# EAGLE design earing (EAGLE 9.5.0)
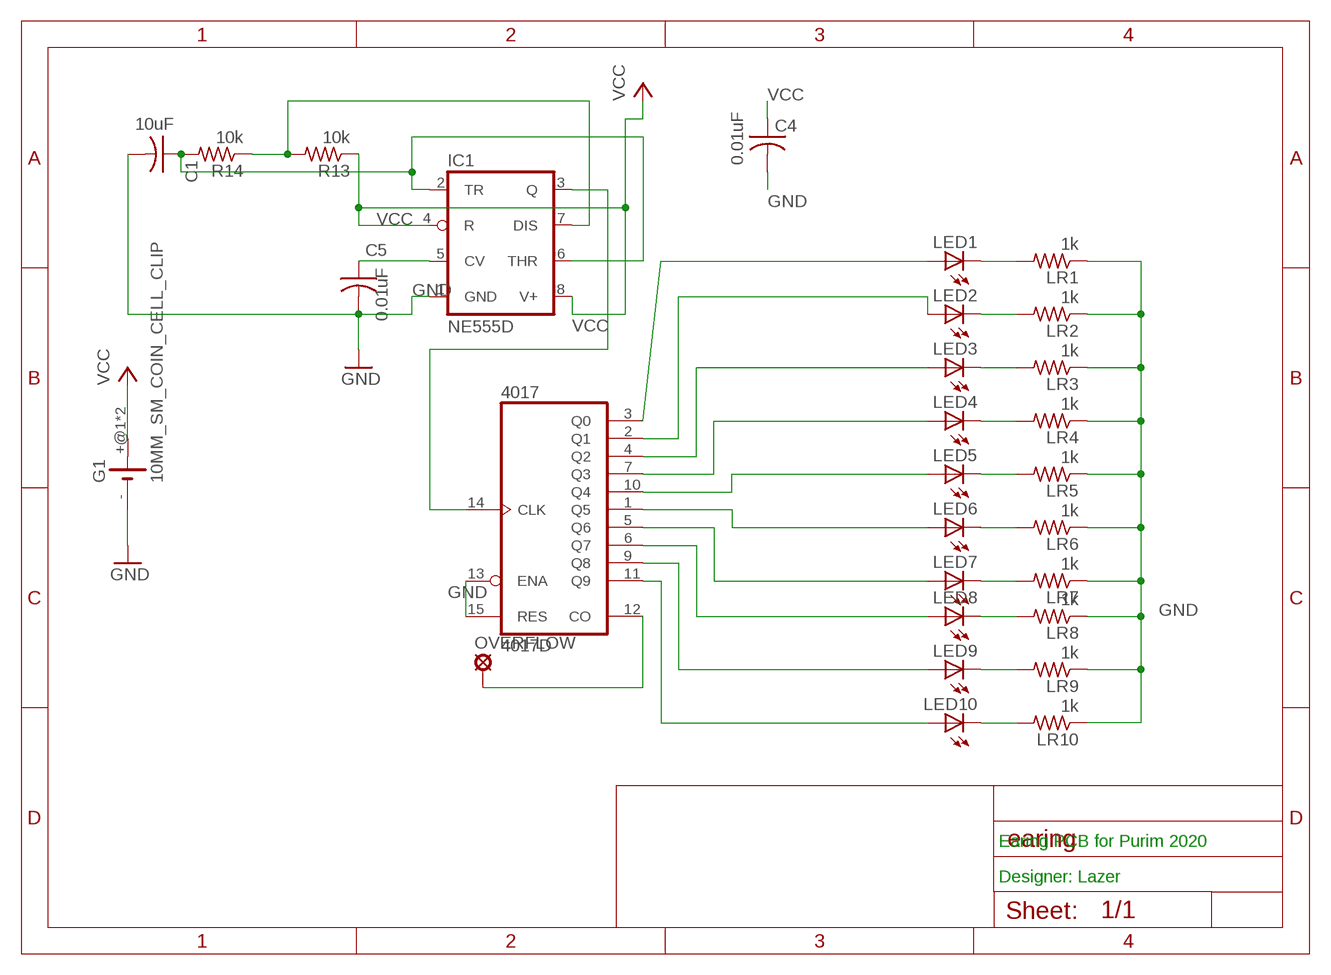
[diagram p0: schematic, sheet 1]

## Parts
4017  4017D  [SO16]
C1  10uF  C-USC0805  [C0805]
C4  0.01uF  C-USC0805  [C0805]
C5  0.01uF  C-USC0805  [C0805]
G1  10MM_SM_COIN_CELL_CLIP  [10MM_SM_COIN_CELL_CLIP]
IC1  NE555D  [SO08]
LED1  LEDCHIP-LED0805  [CHIP-LED0805]
LED2  LEDCHIP-LED0805  [CHIP-LED0805]
LED3  LEDCHIP-LED0805  [CHIP-LED0805]
LED4  LEDCHIP-LED0805  [CHIP-LED0805]
LED5  LEDCHIP-LED0805  [CHIP-LED0805]
LED6  LEDCHIP-LED0805  [CHIP-LED0805]
LED7  LEDCHIP-LED0805  [CHIP-LED0805]
LED8  LEDCHIP-LED0805  [CHIP-LED0805]
LED9  LEDCHIP-LED0805  [CHIP-LED0805]
LED10  LEDCHIP-LED0805  [CHIP-LED0805]
LR1  1k  R-US_M0805  [M0805]
LR2  1k  R-US_M0805  [M0805]
LR3  1k  R-US_M0805  [M0805]
LR4  1k  R-US_M0805  [M0805]
LR5  1k  R-US_M0805  [M0805]
LR6  1k  R-US_M0805  [M0805]
LR7  1k  R-US_M0805  [M0805]
LR8  1k  R-US_M0805  [M0805]
LR9  1k  R-US_M0805  [M0805]
LR10  1k  R-US_M0805  [M0805]
OVERFLOW  LSP10  [LSP10]
R13  10k  R-US_M0805  [M0805]
R14  10k  R-US_M0805  [M0805]

## Nets
GND: 4017.13(ENA) 4017.15(RES) C1.2 C4.2 C5.2 G1.- IC1.1(GND) LR1.1 LR2.1 LR3.1 LR4.1 LR5.1 LR6.1 LR7.1 LR8.1 LR9.1 LR10.1
N$1: 4017.3(Q0) LED1.A
N$2: 4017.12(CO) OVERFLOW.MP
N$3: 4017.2(Q1) LED2.A
N$6: 4017.4(Q2) LED3.A
N$8: 4017.7(Q3) LED4.A
N$9: 4017.10(Q4) LED5.A
N$10: 4017.1(Q5) LED6.A
N$11: 4017.5(Q6) LED7.A
N$12: 4017.6(Q7) LED8.A
N$13: 4017.9(Q8) LED9.A
N$14: 4017.11(Q9) LED10.A
N$15: LED10.C LR10.2
N$16: LED9.C LR9.2
N$17: LED8.C LR8.2
N$18: LED7.C LR7.2
N$19: LED6.C LR6.2
N$20: LED5.C LR5.2
N$21: LED4.C LR4.2
N$22: LED3.C LR3.2
N$23: LED2.C LR2.2
N$24: LED1.C LR1.2
N$27: C5.1 IC1.5(CV)
N$29: IC1.7(DIS) R13.2 R14.1
N$30: 4017.14(CLK) IC1.3(Q)
N$31: C1.1 IC1.2(TR) IC1.6(THR) R14.2
VCC: C4.1 G1.+@1(+) G1.+@2(+) IC1.4(R) IC1.8(V+) R13.1

## Notes on the sheet
- Earing PCB for Purim 2020
- Designer: Lazer

## Power pins joined to a net without a drawn wire
VCC: 4017.16(VDD)
VSS: 4017.8(VSS)

## Library data of the parts
4017 = 40xx:4017: COUNTER/DIVIDER
C1 C4 C5 = adafruit:C-US: CAPACITOR, American symbol
G1 = battery:10MM_SM_COIN_CELL_CLIP: Battery cell clip for CR927 Source: KEYSTONE ELECTRONICS CORP. www.keyelco.com, ASTORIA, N.Y. 11105-2017 PART ANME 10mm SM COIN CELl CLIP DWG NO. 3030
IC1 = adafruit:*555: TIMER Changed DIP package to have round (not oval) pin pads http://www.ladyada.net/library/pcb/eaglelibrary.html
LED1-LED10 = adafruit:LED: LED OSRAM: - CHIPLED LG R971, LG N971, LY N971, LG Q971, LY Q971, LO R971, LY R971 LH N974, LH R974 LS Q976, LO Q976, LY Q976 LO Q996 - Hyper CHIPLED LW Q18S LB Q993, LB Q99A, LB R99A - SideLED LS A670, LO A670, LY A670, LG A670, LP A670 LB A673, LV A673, LT A673, LW A673 LH A674 LY A675 LS A676, LA A676, LO A676, LY A676, LW A676 LS A679, LY A679, LG A679 - Hyper Micro SIDELED® LS Y876, LA Y876, LO Y876, LY Y876 LT Y87S - SmartLED LW L88C, LW L88S LB L89C, LB L89S, LG L890 LS L89K, LO L89K, LY L89K LS L896, LA L896, LO L896, LY L896 - TOPLED LS T670, LO T670, LY T670, LG T670, LP T670 LSG T670, LSP T670, LSY T670, LOP T670, LYG T670 LG T671, LOG T671, LSG T671 LB T673, LV T673, LT T673, LW T673 LH T674 LS T676, LA T676, LO T676, LY T676, LB T676, LH T676, LSB T676, LW T676 LB T67C, LV T67C, LT T67C, LS T67K, LO T67K, LY T67K, LW E67C LS E67B, LA E67B, LO E67B, LY E67B, LB E67C, LV E67C, LT E67C LW T67C LS T679, LY T679, LG T679 LS T770, LO T770, LY T770, LG T770, LP T770 LB T773, LV T773, LT T773, LW T773 LH T774 LS E675, LA E675, LY E675, LS T675 LS T776, LA T776, LO T776, LY T776, LB T776 LHGB T686 LT T68C, LB T68C - Hyper Mini TOPLED® LB M676 - Mini TOPLED Santana® LG M470 LS M47K, LO M47K, LY M47K Source: http://www.osram.convergy.de/
LR1-LR10 R13 R14 = adafruit:R-US_: RESISTOR, American symbol
OVERFLOW = solpad:LSP10: SOLDER PAD drill 1.0 mm, distributor Buerklin, 12H555

## Board
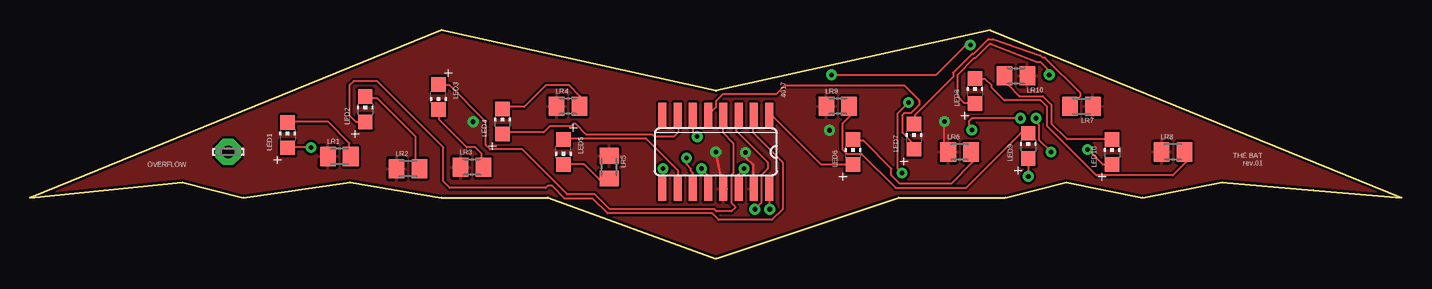
[diagram p1: board, top side]
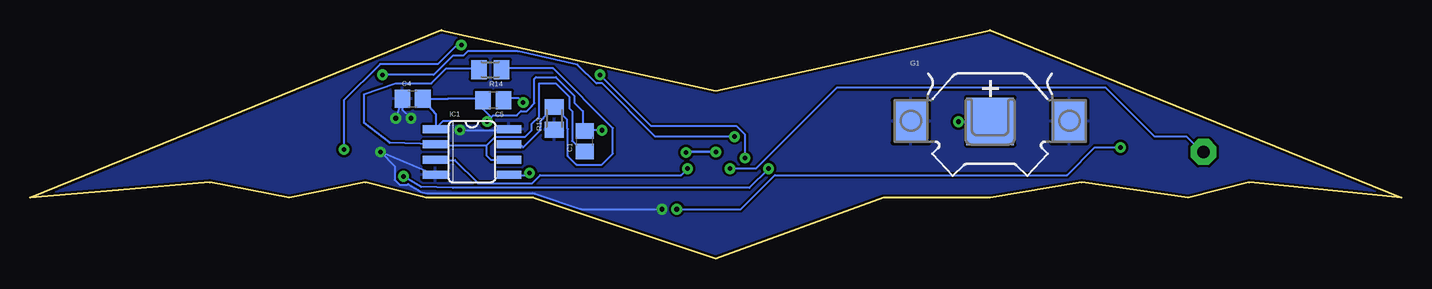
[diagram p2: board, bottom side, seen from below]

Size 114.3 x 19.05 mm. Coordinates in mm from the lower left corner, seen from the top.
Outline: 80.01,19.05 57.15,13.97 34.29,19.05 0,5.08 12.7,6.35 17.78,5.08 26.67,6.35 34.29,5.08 43.18,5.08 57.15,0 72.39,5.08 81.28,5.08 86.36,6.35 92.71,5.08 99.31,6.35 106.93,5.72 114.3,5.08 80.01,19.05
Copper layers (1*16): Top 0.035mm / dielectric 1.5mm / Bottom 0.035mm
Design rules "SparkFun *": minimum track width 6mil, minimum drill 15mil, track to track 8mil, track to pad 8mil, pad to pad 8mil, via to via 8mil, smd to smd 8mil, copper to edge 8mil, drill to drill 8mil, minimum pad ring 12mil, minimum via ring 10mil, stop-mask expansion 4mil, vias tented up to drill 20mil, thermal gap 10mil

### Footprints (pad centres in the part's own frame; a part is rotated, then mirrored left to right if it is on the bottom)
SO16 = smd 0.66 x 2.032: 1 -4.445,-3.073; 2 -3.175,-3.073; 3 -1.905,-3.073; 4 -0.635,-3.073; 5 0.635,-3.073; 6 1.905,-3.073; 7 3.175,-3.073; 8 4.445,-3.073; 9 4.445,3.073; 10 3.175,3.073; 11 1.905,3.073; 12 0.635,3.073; 13 -0.635,3.073; 14 -1.905,3.073; 15 -3.175,3.073; 16 -4.445,3.073
C0805 = smd 1.3 x 1.5: 1 -0.85,0; 2 0.85,0
10MM_SM_COIN_CELL_CLIP = smd 2.9 x 3.5: +@1 -6.6,0; +@2 6.6,0 | smd 3.96 x 3.96: - 0,0
SO08 = smd 0.66 x 2.032: 1 -1.905,-3.073; 2 -0.635,-3.073; 3 0.635,-3.073; 4 1.905,-3.073; 5 1.905,3.073; 6 0.635,3.073; 7 -0.635,3.073; 8 -1.905,3.073
CHIP-LED0805 = smd 1.2 x 1.2: A 0,-1.05; C 0,1.05
M0805 = smd 1.3 x 1.6: 1 -0.95,0; 2 0.95,0
LSP10 = drill 1.016 pad 2.159 octagon: MP 0,0

### Placement (x,y rotation side)
4017  57.15,8.89 180 top
C1  68.07,9.78 90 bottom
C4  82.42,13.33 0 bottom
C5  75.69,13.21 180 bottom
G1  34.29,11.43 0 bottom
IC1  77.47,8.89 270 bottom
LED1  21.46,10.29 0 top
LED2  27.94,12.45 0 top
LED3  34.04,13.46 180 top
LED4  39.37,11.43 0 top
LED5  44.45,8.89 180 top
LED6  68.58,8.89 0 top
LED7  73.66,10.16 0 top
LED8  78.74,13.97 0 top
LED9  83.18,9.4 0 top
LED10  90.17,8.89 0 top
LR1  25.78,8.51 0 top
LR2  31.5,7.49 0 top
LR3  36.83,7.62 0 top
LR4  44.83,12.7 0 top
LR5  48.26,7.62 270 top
LR6  77.47,8.89 0 top
LR7  87.63,12.7 180 top
LR8  95.25,8.89 0 top
LR9  67.31,12.7 0 top
LR10  82.17,15.24 180 top
OVERFLOW  16.51,8.89 0 top
R13  70.61,11.68 90 bottom
R14  75.95,15.75 180 bottom

### Tracks (layer width: path | path; a pad name or v marks a point on that pad's centre or on a via)
GND  (via drill 0.38)
  Top 0.152: LR6.1 76.2,9.21 v76.2,11.43
  Top 0.203: 4017.15 60.26,5.88 60.26,7.8 59.69,8.38 59.69,8.89 v59.63,8.83 | v57.15,8.89 4017.13
  Bottom 0.152: v66.62,10.69 68.05,10.69 C1.2 68.22,10.69 68.22,12.29 68.94,13 68.94,13.56 70.48,15.11 72.14,15.11 72.26,14.99 72.26,12.95 72.48,12.74 72.48,12.7 72.9,12.28 73.39,12.28 73.74,11.94 75.69,11.94 75.87,11.76 76.58,12.47 76.58,13.18 C5.2 76.58,13.36 79.43,13.36 79.47,13.33 C4.2 80.49,12.06 80.49,10.87 IC1.1 79.91,11.43 v76.2,11.43 | v36.93,11.4 34.44,11.4 G1.-
  Bottom 0.203: v59.63,8.83 59.69,8.89 v57.15,8.89
  pour Top: 0,5.08 34.29,19.05 57.15,13.97 80.01,19.05 114.3,5.08 99.06,6.35 92.71,5.08 86.36,6.35 81.28,5.08 72.39,5.08 57.15,0 43.18,5.08 34.29,5.08 26.67,6.35 17.78,5.08 12.7,6.35
N$1  (via drill 0.38)
  Top 0.152: v23.42,9.27 21.46,9.27 LED1.A | v60.4,4.11 60.94,4.65 60.94,6.96 61.47,7.49 61.47,8.03 58.8,10.69 58.98,10.87 58.98,11.94 4017.3
  Bottom 0.152: v23.42,9.27 25.55,9.27 27.86,6.96 52.22,6.96 55.07,4.11 v60.4,4.11
N$2  (via drill 0.38)
  Top 0.152: v55.96,7.49 56.49,6.96 56.49,5.89 4017.12
  Bottom 0.152: v55.96,7.49 53.82,7.49 47.07,14.25 24.66,14.25 20.57,10.16 17.91,10.16 16.66,8.91 OVERFLOW.MP
N$3
  Top 0.152: LED2.A 27.86,11.4 27.15,11.4 26.62,11.94 26.62,14.43 26.98,14.78 28.93,14.78 34.44,9.27 34.44,6.43 34.98,5.89 42.98,5.89 43.16,6.07 43.51,6.07 44.58,5 46.89,5 48.13,3.76 56.84,3.76 57.38,3.23 61.82,3.23 62.71,4.11 62.71,8.03 60.22,10.52 60.22,11.94 4017.2
N$6
  Top 0.152: LED3.A 34.09,14.43 34.98,14.43 38,11.4 38,9.45 38.35,9.09 41.02,9.09 44.76,5.36 47.07,5.36 48.31,4.11 57.02,4.11 57.2,3.94 58.45,3.94 58.8,4.29 58.45,4.65 58.45,6.96 58.62,7.14 58.62,9.63 57.73,10.52 57.73,11.94 4017.4
N$8
  Top 0.152: LED4.A 39.42,10.52 42.8,10.52 43.33,11.05 45.11,11.05 45.29,11.23 45.47,11.23 46.36,10.34 51.87,10.34 52.05,10.16 53.65,10.16 54,10.52 54,11.94 4017.7
N$9
  Top 0.152: LED5.A 44.58,9.98 51.33,9.98 54,7.32 54,5.89 4017.10
N$10
  Top 0.152: LED6.A 65.91,7.85 61.65,12.12 4017.1
N$11
  Top 0.152: LED7.A 73.56,9.27 73.56,9.63 72.67,10.52 72.67,11.94 72.85,12.12 73.38,12.12 74.09,12.83 74.09,13.18 72.85,14.43 62.89,14.43 62.18,13.72 57.73,13.72 57.15,13.13 57.15,12.6 4017.5
N$12  (via drill 0.38)
  Top 0.152: v84.94,15.32 84.94,15.67 84.23,16.38 83.98,16.38 80.01,17.91 79.99,17.91 78.81,16.73 78.7,16.73 77.29,15.32 77.29,13.54 77.83,13 78.71,13 LED8.A | v55.6,10.16 55.24,10.52 4017.6
  Bottom 0.152: v84.94,15.32 80.67,15.32 79.07,16.92 78.18,16.92 77.83,17.27 73.65,17.27 68.68,16.17 67.1,14.59 66.61,14.59 62.18,10.16 v55.6,10.16
N$13  (via drill 0.38)
  Top 0.152: v52.76,7.49 52.76,5.89 4017.9 | LED9.A v83.18,6.86
  Bottom 0.152: v52.76,7.49 54.36,5.89 79.07,5.89 81.73,5.98 v83.18,6.86
N$14  (via drill 0.38)
  Top 0.152: v88.14,9.09 89.38,7.85 90.09,7.85 LED10.A | v78.36,17.8 78,17.8 75.51,15.32 v66.8,15.32 | v54.71,8.38 54.71,7.85 55.07,7.49 55.07,7.32 55.24,7.14 4017.11
  Bottom 0.152: v88.14,9.09 88.14,13.18 85.11,16.2 80.31,16.2 78.71,17.8 v78.36,17.8 | v66.8,15.32 62.54,11.05 55.42,11.05 54.71,10.34 v54.71,8.38
N$15
  Top 0.152: LED10.C 90.09,9.98 86.38,9.98 85.11,11.25 85.11,12.83 84.4,13.54 82.45,13.54 81.56,14.43 81.24,15.21 LR10.2
N$16
  Top 0.152: LED9.C 82.56,10.45 78,5.89 72.14,5.89 69.29,8.74 68.05,8.74 67.69,9.09 67.69,11.23 68.4,11.94 68.4,12.65 LR9.2
N$17
  Top 0.152: LED8.C 78.89,14.96 79.6,14.96 80.14,14.43 80.14,14.25 81.2,13.18 84.23,13.18 84.76,12.65 84.76,11.05 88.88,6.93 95.22,6.93 96.32,8.03 96.32,8.74 LR8.2
N$18
  Top 0.152: LR7.2 87.5,13.52 87.5,13.82 84.58,16.74 84.4,16.74 84.23,16.92 80.26,18.29 79.86,18.29 78.66,17.08 78.52,17.08 76.94,15.49 76.94,15.14 73.74,11.94 73.74,11.23 LED7.C
N$19
  Top 0.152: LED6.C 68.58,9.8 69.47,9.8 71.78,7.49 71.78,6.96 72.49,6.25 76.76,6.25 78.54,8.03 78.54,8.74 LR6.2
N$20
  Top 0.152: LED5.C 44.58,7.85 46.18,7.85 47.42,6.6 48.13,6.6 LR5.2
N$21
  Top 0.152: LED4.C 39.42,12.65 41.2,12.65 42.98,14.43 44.93,14.43 45.82,13.54 45.82,12.83 LR4.2
N$22
  Top 0.152: LED3.C 34.09,12.29 34.09,11.58 36.4,9.27 37.11,9.27 37.64,8.74 37.64,7.67 LR3.2
N$23
  Top 0.152: LED2.C 28.04,13.36 28.93,13.36 32.13,10.16 32.13,7.67 32.31,7.49 LR2.2
N$24
  Top 0.152: LED1.C 21.46,11.4 24.84,11.4 26.62,9.63 26.62,8.56 LR1.2
N$27  (via drill 0.38)
  Top 0.152: v73.2,13 72.31,12.12 72.31,7.49 v72.67,7.14
  Bottom 0.152: v73.2,13 73.56,13.36 74.8,13.36 C5.1 | v72.67,7.14 72.85,6.96 74.27,6.96 IC1.5
N$29
  Bottom 0.152: IC1.7 74.27,9.45 73.38,9.45 73.2,9.27 71.78,10.69 71.78,11.43 71.53,11.69 71.53,11.72 R13.2 69.53,11.55 69.53,10.86 69.47,10.79 69.47,8.53 68.76,7.82 66.65,7.82 65.73,8.74 65.73,10.87 70.71,15.85 74.98,15.85 R14.1
N$30  (via drill 0.38)
  Top 0.152: v59.51,7.49 58.98,6.96 58.98,5.89 4017.14
  Bottom 0.152: v59.51,7.49 60.05,6.96 71.78,6.96 72.47,6.27 76.96,6.27 78.89,8.2 80.49,8.2 IC1.3
N$31
  Bottom 0.152: 76.22,9.45 75.51,10.16 73.02,10.16 72.49,10.69 72.49,11.23 71.88,11.84 71.88,14.61 70.48,14.61 69.34,13.47 69.34,12.52 69.11,12.29 69.11,9.8 68.76,9.45 68.58,9.45 68.22,9.09 C1.1 | 76.22,9.45 76.22,8.56 75.87,8.2 74.45,8.2 IC1.6 | R14.2 76.94,15.85 79.6,15.85 80.85,14.61 83.8,14.61 86.49,13.68 86.49,11.3 84.33,9.65 IC1.2 80.49,9.45 76.22,9.45
VCC  (via drill 0.38)
  Top 0.152: v61.65,4.11 61.65,5.72 4017.16 | v82.55,11.7 78.5,11.7 78.23,11.43 78.23,10.96 v78.49,10.71 | v83.82,11.7 83.82,11.41 84.06,11.16 84.06,9.92 v85.09,8.89
  Bottom 0.152: v82.55,11.7 83.27,12.42 C4.1 v83.82,11.7 | v78.49,10.71 74.48,10.71 IC1.8 | IC1.4 v85.09,8.89 83.91,7.71 83.91,6.56 83.48,6.13 82.88,6.13 82.8,6.22 81.95,5.7 81.89,5.63 81.83,5.63 81.77,5.57 81.24,5.44 72.47,5.44 72.42,5.46 72.33,5.44 72.24,5.44 72.2,5.39 68.37,4.11 v61.65,4.11
  pour Bottom: 0,5.08 34.29,19.05 57.15,13.97 80.01,19.05 114.3,5.08 99.06,6.35 92.71,5.08 86.36,6.35 81.28,5.08 72.39,5.08 57.15,0 43.18,5.08 34.29,5.08 26.67,6.35 17.78,5.08 12.7,6.35

### Text on the board
tNames: THE BAT / rev.01